# EAGLE design ws2811_eagle (EAGLE 8.5.0)
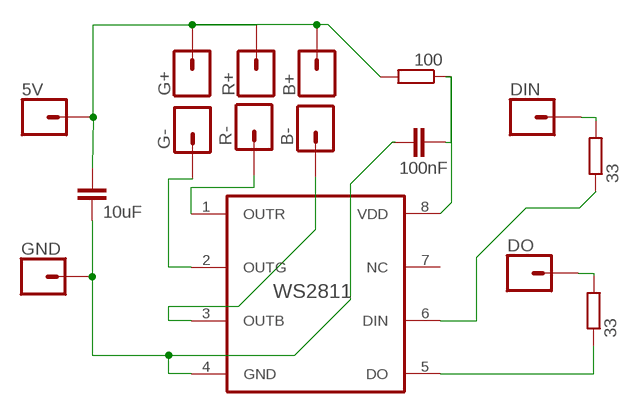
[diagram p0: schematic, sheet 1]

## Parts
5V  1PIN  [1PIN_1.0MMCORE]
B+  1PIN1PIN_0.8MMCORE  [1PIN_0.8MMCORE]
B-  1PIN1PIN_0.8MMCORE  [1PIN_0.8MMCORE]
C1  10uF  C-EUC0805  [C0805]
C2  100nF  C-EUC0805  [C0805]
DIN  1PIN  [1PIN_1.0MMCORE]
DO  1PIN  [1PIN_1.0MMCORE]
G+  1PIN1PIN_0.8MMCORE  [1PIN_0.8MMCORE]
G-  1PIN1PIN_0.8MMCORE  [1PIN_0.8MMCORE]
GND  1PIN  [1PIN_1.0MMCORE]
R1  33  R-EU_R0805  [R0805]
R2  100  R-EU_R0805  [R0805]
R3  33  R-EU_R0805  [R0805]
R+  1PIN1PIN_0.8MMCORE  [1PIN_0.8MMCORE]
R-  1PIN1PIN_0.8MMCORE  [1PIN_0.8MMCORE]
WS2811  WS2811  [SO08]

## Nets
N$1: C2.2 R2.1 WS2811.8(VDD)
N$2: C1.2 C2.1 GND.1 WS2811.4(GND)
N$4: R1.1 WS2811.6(DIN)
N$5: DIN.1 R1.2
N$6: R-.1 WS2811.1(OUTR)
N$7: G-.1 WS2811.2(OUTG)
N$8: B-.1 WS2811.3(OUTB)
N$9: R3.1 WS2811.5(DO)
N$10: 5V.1 B+.1 C1.1 G+.1 R2.2 R+.1
N$11: DO.1 R3.2
Unconnected: WS2811.7(NC)

## Library data of the parts
5V B+ B- DIN DO G+ G- GND R- = giliam_library:1PIN
C1 C2 = rcl:C-EU: CAPACITOR, European symbol; SPICEPREFIX: C; VOLTAGERATING: 10+ V
R1-R3 = resistor:R-EU_: RESISTOR, European symbol
R+ = giliam_library:1PIN; SPICEPREFIX: X
WS2811 = giliam_library:WS2811

## Board
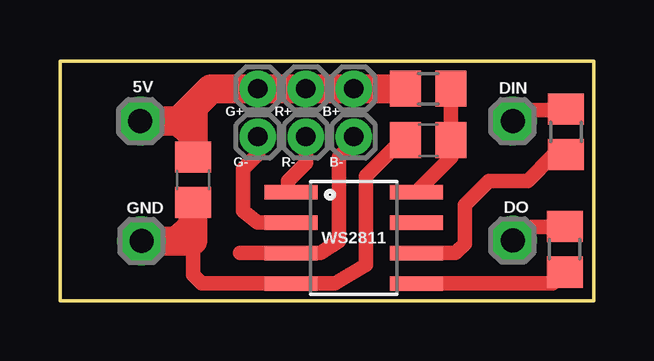
[diagram p1: board, top side]

Size 22.25 x 10 mm. Coordinates in mm from the lower left corner, seen from the top.
Outline: 0,0 0,10 22.25,10 22.25,0 0,0
Copper layers (1*16): Top 0.035mm / dielectric 1.5mm / Bottom 0.035mm
Design rules "default": minimum track width 6mil, minimum drill 0.35mm, track to track 6mil, track to pad 6mil, pad to pad 6mil, via to via 6mil, smd to smd 6mil, copper to edge 40mil, drill to drill 6mil, minimum pad ring 10mil, minimum via ring 8mil, stop-mask expansion 4mil, vias tented up to drill 0mil, thermal gap 10mil

### Footprints (pad centres in the part's own frame; a part is rotated, then mirrored left to right if it is on the bottom)
1PIN_1.0MMCORE = drill 1 pad 2.032: 1 0,0
1PIN_0.8MMCORE = drill 0.8 pad 1.524: 1 0,0
C0805 = smd 1.3 x 1.5: 1 -0.95,0; 2 0.95,0
R0805 = smd 1.3 x 1.5: 1 -0.95,0; 2 0.95,0
SO08 = smd 0.61 x 2.21: 1 -1.905,-2.616; 2 -0.635,-2.616; 3 0.635,-2.616; 4 1.905,-2.616; 5 1.905,2.616; 6 0.635,2.616; 7 -0.635,2.616; 8 -1.905,2.616

### Placement (x,y rotation side)
5V  3.35,7.5 0 top
B+  12.25,8.85 90 top
B-  12.25,6.85 90 top
C1  5.55,5.05 270 top
C2  15.35,6.7 0 top
DIN  18.88,7.5 0 top
DO  18.88,2.52 0 top
G+  8.25,8.85 90 top
G-  8.25,6.85 90 top
GND  3.4,2.5 0 top
R1  21.1,7.05 90 top
R2  15.35,8.85 180 top
R3  21.05,2.15 90 top
R+  10.25,8.85 90 top
R-  10.25,6.85 90 top
WS2811  12.25,2.62 270 top

### Tracks (layer width: path | path; a pad name or v marks a point on that pad's centre or on a via)
N$1
  Top 0.5: R2.1 16.3,8.4
  Top 0.6: WS2811.8 16.32,5.99 C2.2 16.3,8.4
N$2
  Top 0.6: C2.1 14.18,6.62 12.75,5.2 12.75,1.5 11.47,0.72 WS2811.4 5.91,0.72 5.55,1.07 5.55,3.1
  Top 1.2: GND.1 3.95,2.5 | GND.1 4.85,2.5 5.55,3.1 C1.2 5.55,2.5 GND.1
N$4
  Top 0.152: R1.1 20.6,6.1 20.55,6.05
  Top 0.6: WS2811.6 16.49,1.99 16.88,2.38 16.88,4 17.88,5 19.5,5 20.55,6.05 20.86,6.05
N$5
  Top 0.152: R1.2 21.05,7.95 20,7.95
  Top 0.6: 19.05,7.74 19.2,7.95 20,7.95 20.86,7.95
  Top 1: DIN.1 19.05,7.68 19.05,7.74
N$6
  Top 0.6: WS2811.1 9.5,4.66 9.5,5 10.25,5.75 10.25,6.5
  Top 1: R-.1 10.25,6.5
N$7
  Top 0.6: WS2811.2 8.24,3.26 7.62,3.75 7.62,5.5 8.25,6.12 8.25,6.5
  Top 1: G-.1 8.25,6.5
N$8
  Top 0.6: 12.25,6.62 11.62,6 11.62,2.5 10.87,1.99 WS2811.3 7.5,2
  Top 1: B-.1 12.25,6.62
N$9
  Top 0.6: R3.1 20.55,0.72 WS2811.5
N$10
  Top 1.14: 5.6,8.15 5.6,6.05 C1.1
  Top 1.2: R2.2 B+.1 R+.1 G+.1 6.3,8.85 5.6,8.15 4.95,7.5 5V.1 | 5V.1 3.95,7.5 | 5V.1 4.9,7.5 5.5,7 C1.1
N$11
  Top 0.152: R3.2 21.02,3.08 20,3.08
  Top 0.6: DO.1 19.02,2.77 19.2,3.08 20,3.08 20.86,3.08
  Top 1: DO.1 19.02,2.67 19.02,2.77